# Altium schematic sheet main.SchDoc
size A
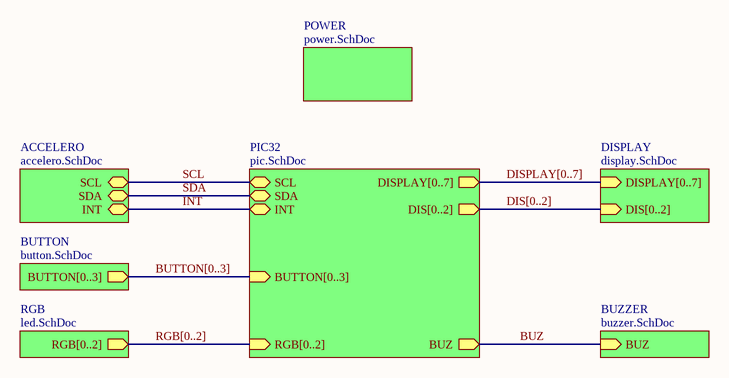
[diagram p0: main.SchDoc]

## Sub-sheets
ACCELERO = accelero.SchDoc: INT (bidir), SDA (bidir), SCL (bidir)
BUTTON = button.SchDoc: BUTTON[0..3] (out)
BUZZER = buzzer.SchDoc: BUZ (in)
DISPLAY = display.SchDoc: DISPLAY[0..7] (in), DIS[0..2] (in)
PIC32 = pic.SchDoc: DISPLAY[0..7] (out), RGB[0..2] (in), BUTTON[0..3] (in), DIS[0..2] (out), INT (bidir), SDA (bidir), SCL (bidir), BUZ (out)
POWER = power.SchDoc: no entries
RGB = led.SchDoc: RGB[0..2] (out)

## Nets
BUZ: sheet PIC32/BUZ, sheet BUZZER/BUZ
INT: sheet PIC32/INT, sheet ACCELERO/INT
SCL: sheet PIC32/SCL, sheet ACCELERO/SCL
SDA: sheet PIC32/SDA, sheet ACCELERO/SDA

## Buses and harness runs
bus BUTTON[0..3] = sheet BUTTON/BUTTON[0..3] = sheet PIC32/BUTTON[0..3]
bus DIS[0..2] = sheet DISPLAY/DIS[0..2] = sheet PIC32/DIS[0..2]
bus DISPLAY[0..7] = sheet DISPLAY/DISPLAY[0..7] = sheet PIC32/DISPLAY[0..7]
bus RGB[0..2] = sheet PIC32/RGB[0..2] = sheet RGB/RGB[0..2]